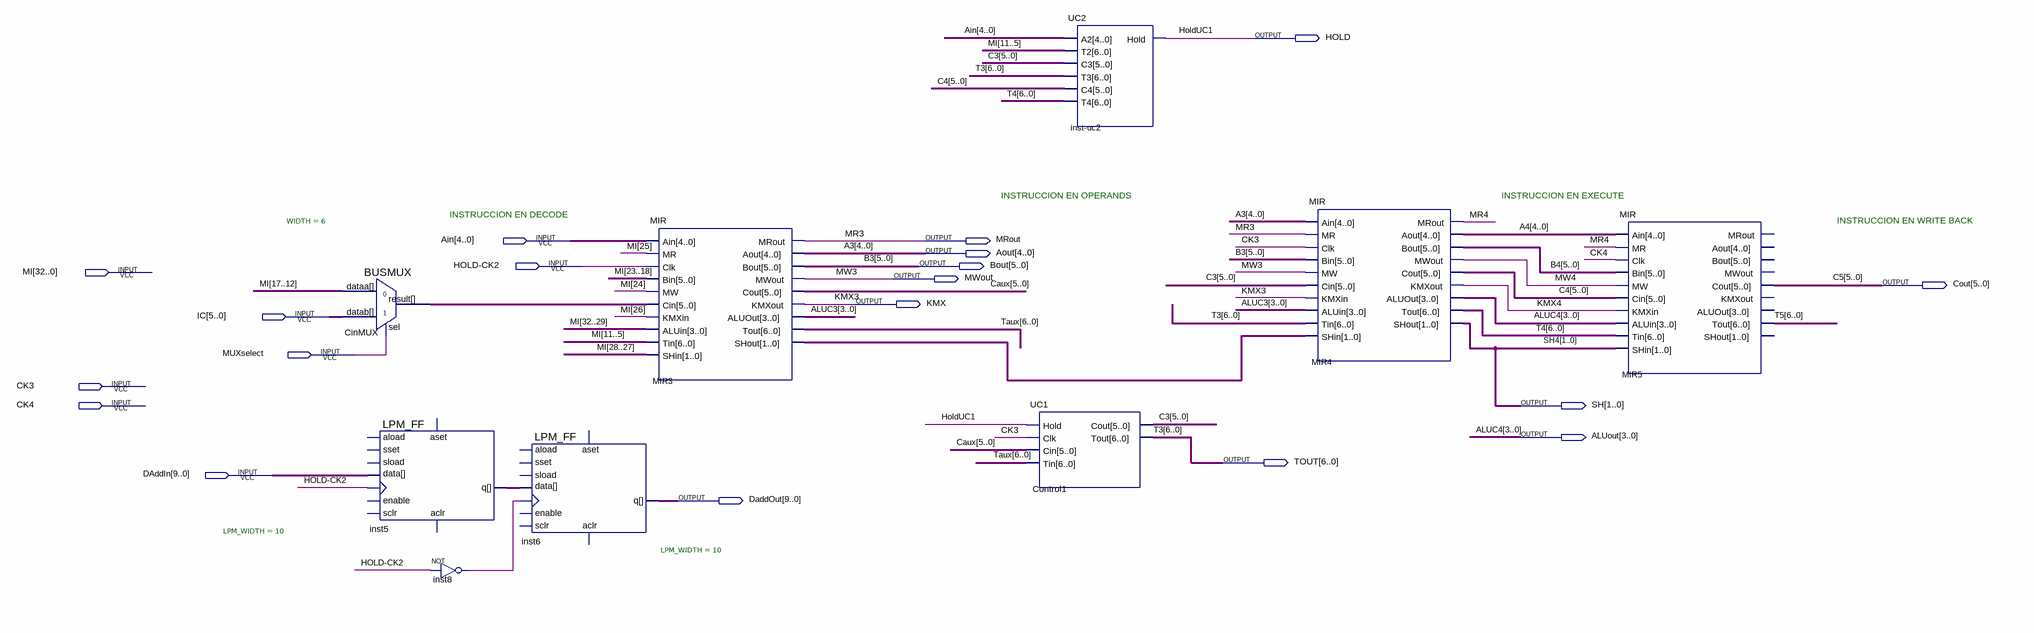
[diagram p0: schematic sheet]
// Quartus schematic MIRUnit.bdf as structural Verilog: 9 symbols, 19 pins
module MIRUnit (
  input  [4:0] Ain,
  input  \HOLD-CK2 ,
  input  [32:0] MI,
  input  [5:0] IC,
  input  MUXselect,
  input  CK3,
  input  CK4,
  input  [9:0] DAddIn,
  output HOLD,
  output MRout,
  output [4:0] Aout,
  output [5:0] Bout,
  output MWout,
  output [5:0] Cout,
  output KMX,
  output [1:0] SH,
  output [3:0] ALUout,
  output [6:0] TOUT,
  output [9:0] DaddOut
);

  wire inst8_out, KMX4, MR4, MW4;
  wire [1:0] MIR3_shout;
  wire [3:0] ALUC3;
  wire [4:0] A4;
  wire [5:0] B4, C3, C4, Caux, CinMUX_result;
  wire [6:0] T4, T5, Taux;
  wire [9:0] inst5_q;

  BUSMUX #(.WIDTH(6)) CinMUX (.datab(IC), .sel(MUXselect), .dataa(MI[17:12]), .result(CinMUX_result));
  LPM_FF #(.LPM_WIDTH(10)) inst5 (
    .clock(\HOLD-CK2 ), .data(DAddIn), .q(inst5_q));  // open: enable, aload, sset, sload, aset, sclr, aclr
  not inst8 (inst8_out, \HOLD-CK2 );
  LPM_FF #(.LPM_WIDTH(10)) inst6 (
    .clock(inst8_out), .data(inst5_q), .q(DaddOut));  // open: enable, aload, sset, sload, aset, sclr, aclr
  MIR MIR3 (
    .Ain(Ain), .MR(MI[25]), .Clk(\HOLD-CK2 ), .Bin(MI[23:18]), .MW(MI[24]), .Cin(CinMUX_result),
    .KMXin(MI[26]), .ALUin(MI[32:29]), .Tin(MI[11:5]), .SHin(MI[28:27]), .MRout(MRout), .Aout(Aout),
    .Bout(Bout), .MWout(MWout), .Cout(Caux), .KMXout(KMX), .ALUOut(ALUC3), .Tout(Taux), .SHout(MIR3_shout));
  UC1 Control1 (.Hold(HOLD), .Clk(CK3), .Cin(Caux), .Tin(Taux), .Cout(C3), .Tout(TOUT));
  UC2 \inst-uc2  (.A2(Ain), .T2(MI[11:5]), .C3(C3), .T3(TOUT), .C4(C4), .T4(T4), .Hold(HOLD));
  MIR MIR4 (
    .Ain(Aout), .MR(MRout), .Clk(CK3), .Bin(Bout), .MW(MWout), .Cin(C3), .KMXin(KMX), .ALUin(ALUC3),
    .Tin(TOUT), .SHin(MIR3_shout), .MRout(MR4), .Aout(A4), .Bout(B4), .MWout(MW4), .Cout(C4), .KMXout(KMX4),
    .ALUOut(ALUout), .Tout(T4), .SHout(SH));
  MIR MIR5 (
    .Ain(A4), .MR(MR4), .Clk(CK4), .Bin(B4), .MW(MW4), .Cin(C4), .KMXin(KMX4), .ALUin(ALUout), .Tin(T4),
    .SHin(SH), .Cout(Cout), .Tout(T5));  // open: MRout, Aout, Bout, MWout, KMXout, ALUOut, SHout

  // Other names for the same wires on the sheet: A3[4:0] = Aout; ALUC4[3:0] = ALUout; B3[5:0] = Bout; C5[5:0] = Cout;
  //   HoldUC1 = HOLD; KMX3 = KMX; MR3 = MRout; MW3 = MWout; SH4[1:0] = SH; T3[6:0] = TOUT

  // Notes on the sheet:
  //   INSTRUCCION EN OPERANDS
  //   INSTRUCCION EN EXECUTE
  //   INSTRUCCION EN DECODE
  //   INSTRUCCION EN WRITE BACK
endmodule
